# Altium schematic sheet Analog_voltage_reference.SchDoc
size A4; Author: Luis Henrique DAvila Possatti; Organization: University of Campinas
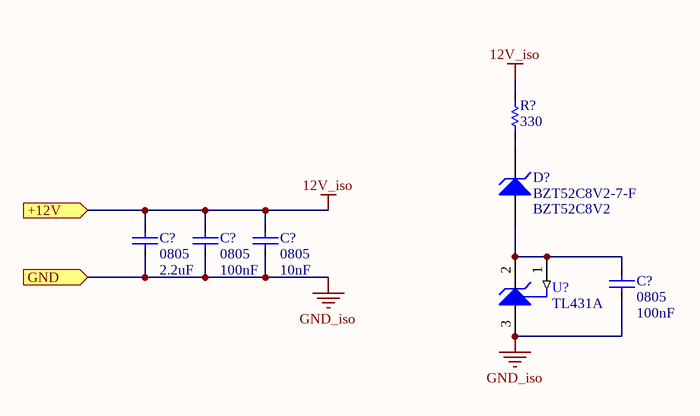
[diagram p0: Analog_voltage_reference.SchDoc]

## Parts
(Parts that share a designator on the sheet are numbered #1, #2 ... from top to bottom, then left to right.)
C?#1  0805  value 2.2uF  [Capacitor 0805]
C?#2  0805  value 100nF  [Capacitor 0805]
C?#3  0805  value 10nF  [Capacitor 0805]
C?#4  0805  value 100nF  [Capacitor 0805]
D?  BZT52C8V2-7-F  value BZT52C8V2  [SOD 123]
R?  value 330  [Resistor 0805]  (hidden comment: Resistor 0805)
U?  TL431A  [SOT 23]

## Ports
+12V (in), GND (in)

## Nets
12V_iso: C?#1.1 C?#2.1 C?#3.1 R?.2 ; port +12V
GND_iso: C?#1.2 C?#2.2 C?#3.2 C?#4.2 U?.3(ANODE) ; port GND
NetC?#4_1: C?#4.1 D?.1(A) U?.1(REF) U?.2(CATHODE)
NetD?_2: D?.2(K) R?.1

## Notes on the sheet
- Title
- Size:
- Date:
- A4
- Number:
- Time:
- Revision:
- Sheet
- of
- Author
- Organization
- File:

## Library data of the parts
C?#1-C?#4 = Capacitor 0805: SMD ceramic capacitor 0805; pn: undefined
D? = BZT52C8V2-7-F: DIODE ZENER 8.2V 500MW SOD123; pn: BZT52C8V2-7-F
R? = Resistor 0805: SMD resistor 0805; pn: undefined
U? = TL431A: IC VREF SHUNT ADJ SOT23-3; pn: TL431AMFDT\,215; ComponentLink1Description: Manufacturer URL; ComponentLink1URL: http://www.ti.com/; ComponentLink2Description: Datasheet; ComponentLink2URL: http://www.ti.com/general/docs/lit/getliterature.tsp?genericPartNumber=TL431A&fileType=pdf; Parameter 2: TL431A